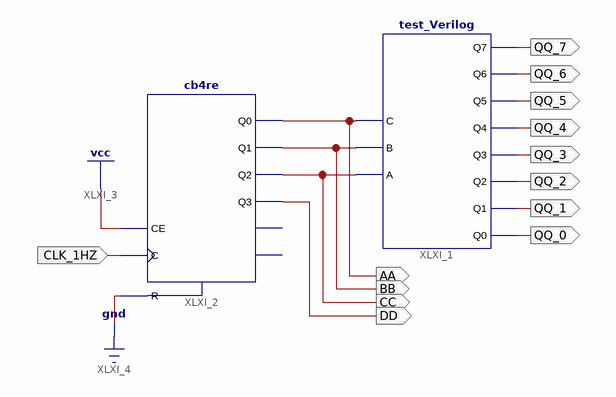
[diagram p0: schematic sheet 1]
// Xilinx ISE schematic composit.sch (xc9500) as structural Verilog: 2 symbols, 13 ports
module composit (
  input  CLK_1HZ,
  output BB,
  output CC,
  output AA,
  output DD,
  output QQ_7,
  output QQ_6,
  output QQ_5,
  output QQ_4,
  output QQ_3,
  output QQ_2,
  output QQ_1,
  output QQ_0
);

  cb4re XLXI_2 (.C(CLK_1HZ), .CE(1'b1), .R(1'b0), .Q0(AA), .Q1(BB), .Q2(CC), .Q3(DD));  // open: CEO, TC
  test_Verilog XLXI_1 (
    .Q7(QQ_7), .Q6(QQ_6), .Q5(QQ_5), .Q4(QQ_4), .Q3(QQ_3), .Q2(QQ_2), .Q1(QQ_1), .Q0(QQ_0), .C(AA), .B(BB),
    .A(CC));
endmodule
